# EasyEDA schematic power_driver_parallelism.json
TITLE: Sheet_1; REV: 1.0; Date: 2024-06-14; Sheet: 1/1; Drawn By: Gabriel Thien; Company: Your Company
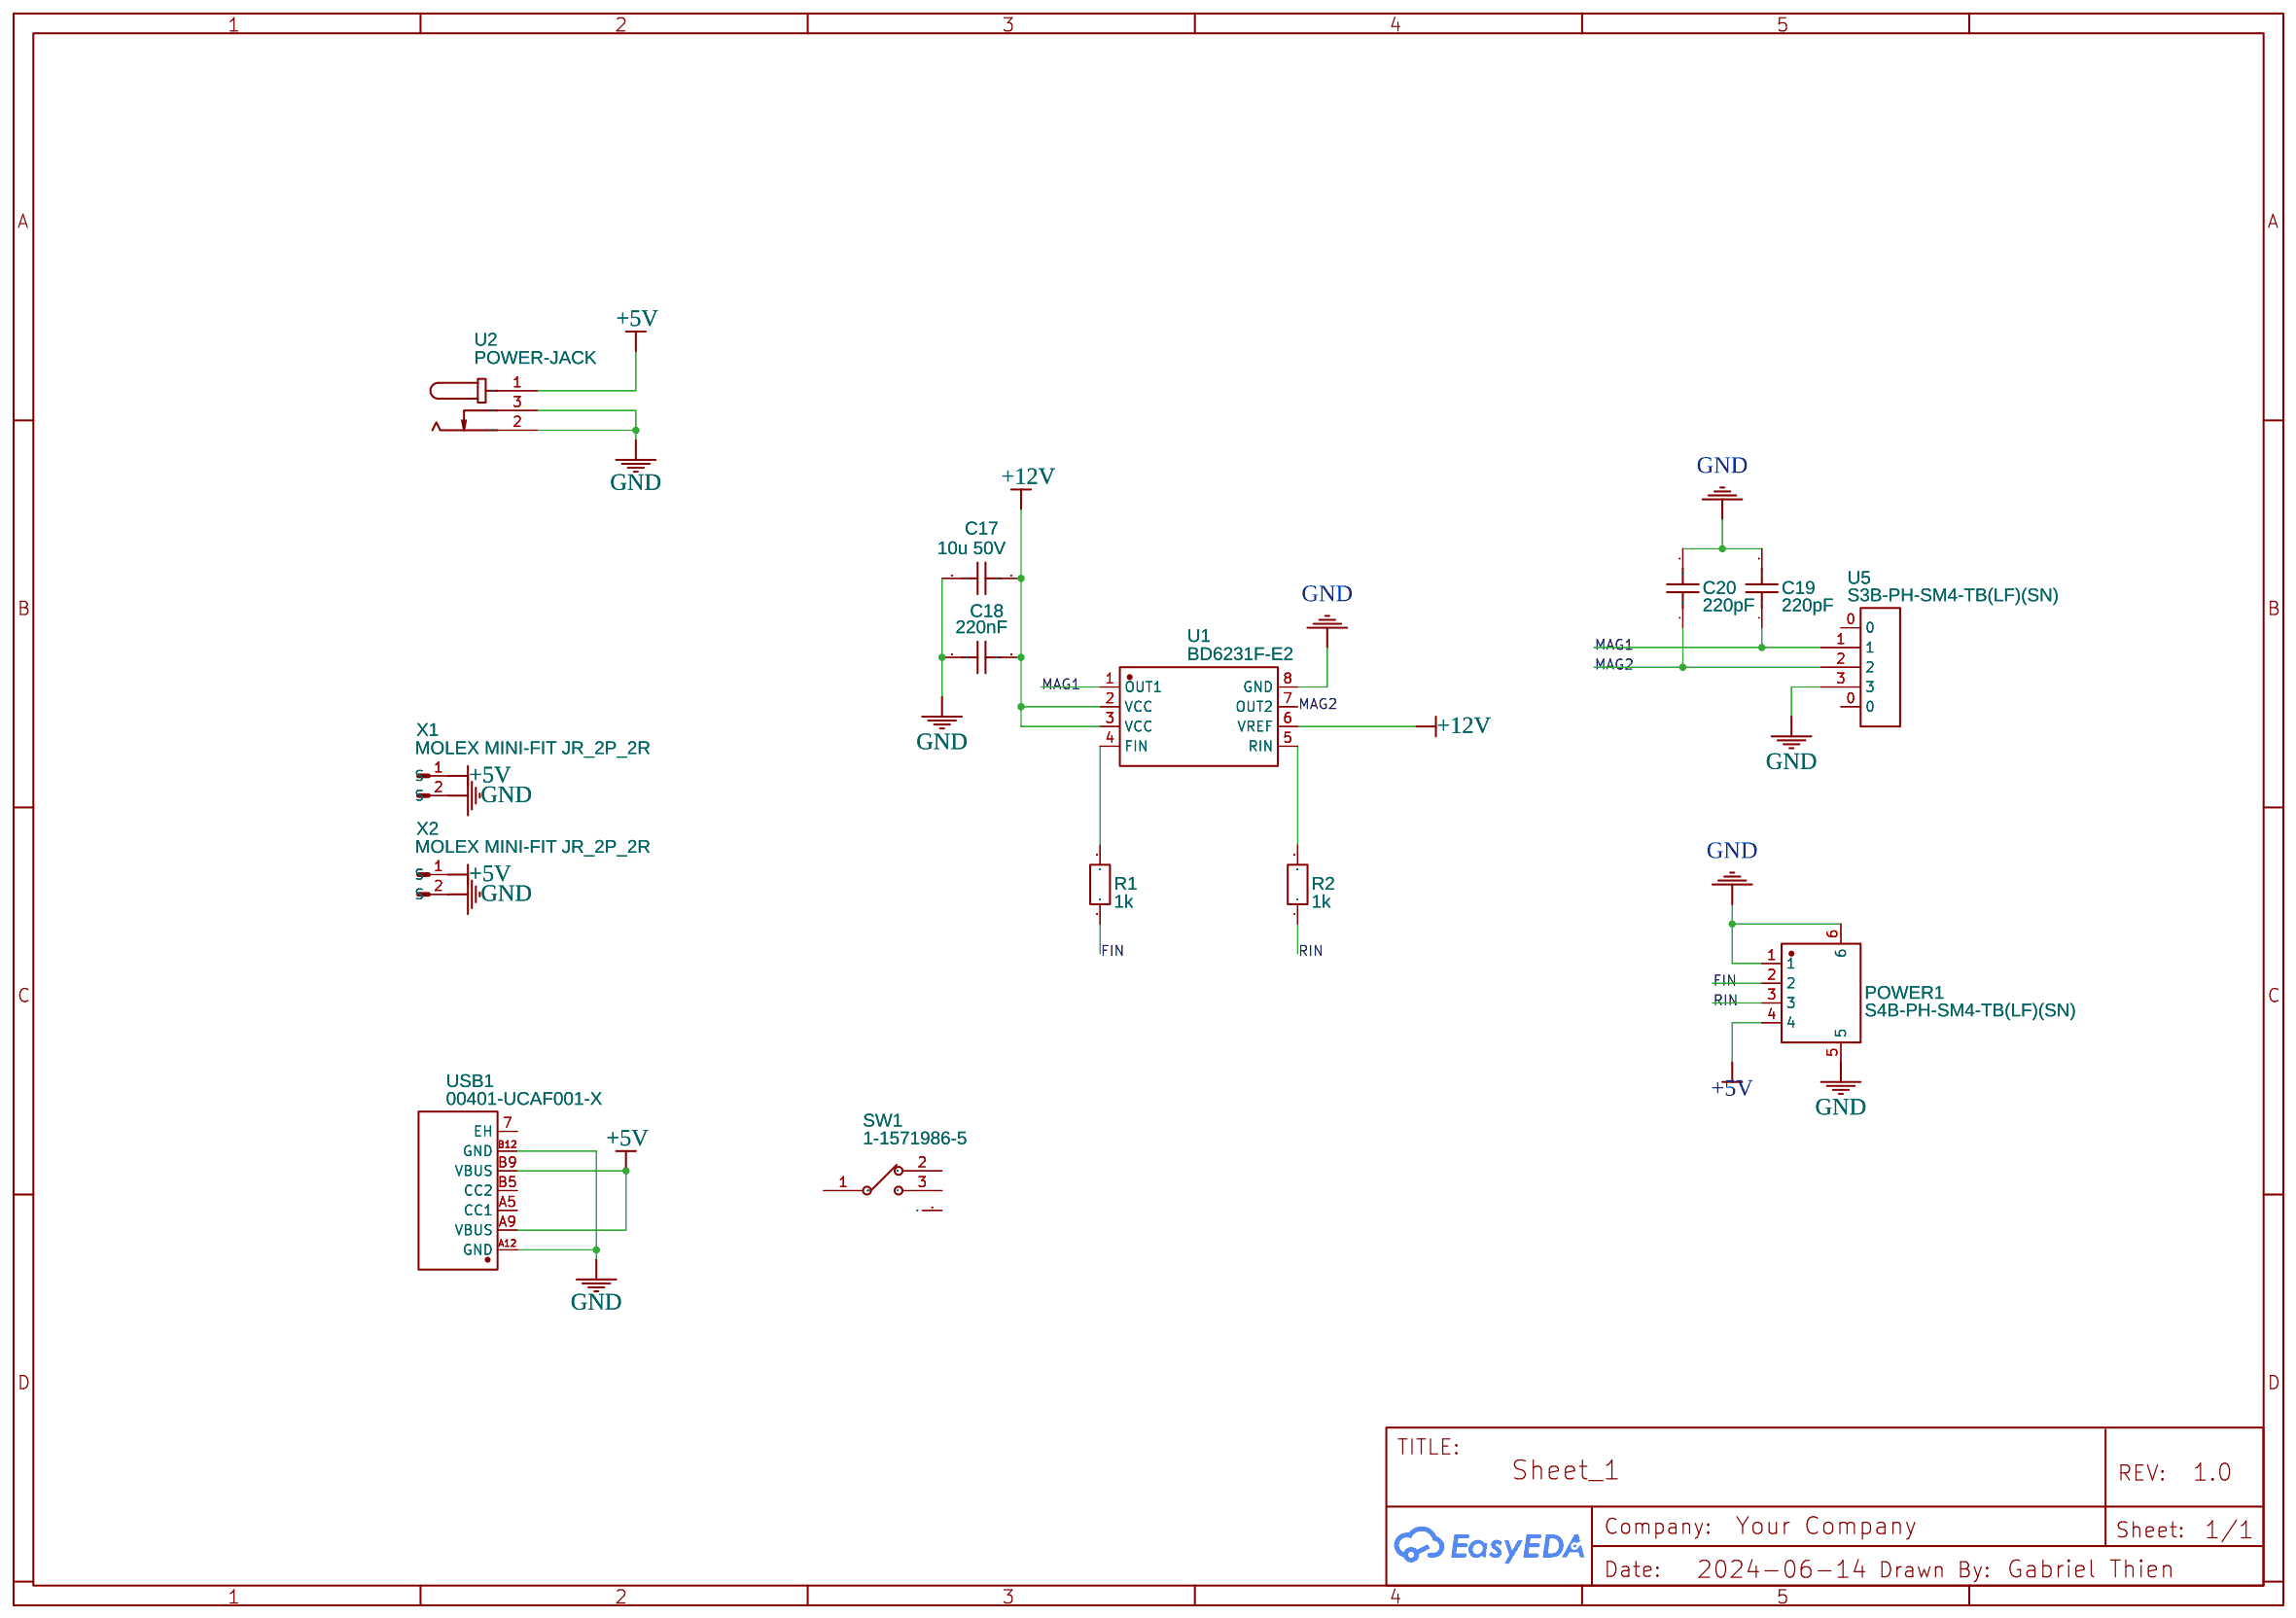
[diagram p0: schematic sheet]

## Parts
C17  10u 50V  [C0603]
C18  220nF  [C0603]
C19  220pF  [C0603]
C20  220pF  [C0603]
POWER1  S4B-PH-SM4-TB(LF)(SN)  [CONN-SMD_S4B-PH-SM4-TB-LF-SN]
R1  1k  [R0603]
R2  1k  [R0603]
SW1  1-1571986-5  [SW-TH_1-1571986-5]
U1  BD6231F-E2  [SOP-8_L5.0-W4.4-P1.27-LS6.2-BL]
U2  POWER-JACK  [DC-IN-TH_POWER-JACK]
U5  S3B-PH-SM4-TB(LF)(SN)  [CONN-SMD_S3B-PH-SM4-TB-LF-SN]
USB1  00401-UCAF001-X  [TYPE-C-SMD_TYPE-C-6P_USB4125-GF-A-0190]
X1  MOLEX MINI-FIT JR_2P_2R  [MOLEX MINI-FIT JR_2P_2R-90]
X2  MOLEX MINI-FIT JR_2P_2R  [MOLEX MINI-FIT JR_2P_2R-90]

## Library data of the parts
C17-C20 = C_0603_US: Contributor: LCEDA_Lib
POWER1 = S4B-PH-SM4-TB(LF)(SN): Contributor: LCSC; Supplier: LCSC; Supplier Part: C265102; Manufacturer: JST; JLCPCB Part Class: Extended Part
R1 R2 = R_0603_EU: Contributor: LCEDA_Lib
SW1 = 1-1571986-5: Contributor: LCSC; Supplier: LCSC; Supplier Part: C92486; Manufacturer: TE Connectivity(泰科电子); JLCPCB Part Class: Extended Part
U1 = BD6231F-E2: Contributor: LCSC; Supplier: LCSC; Supplier Part: C253180; Manufacturer: ROHM(罗姆); JLCPCB Part Class: Extended Part
U2 = POWER-JACK: Contributor: LCSC; Supplier: LCSC; Supplier Part: C9900001795; Manufacturer: 索峰; JLCPCB Part Class: Extended Part; link: https://lcsc.com/eda_search?q=C9900001795&%26type=1&ref=editor
U5 = S3B-PH-SM4-TB(LF)(SN): Contributor: LCSC; Supplier: LCSC; Supplier Part: C265101; Manufacturer: JST; JLCPCB Part Class: Extended Part
USB1 = 00401-UCAF001-X: Supplier: LCSC; Supplier Part: C3148196; Manufacturer: MINTRON(明硕); Contributor: lcsc; JLCPCB Part Class: Extended Part
X1 X2 = MOLEX MINI-FIT JR_2P_2R: Manufacturer: Molex; Manufacturer Part: 0026013114; Supplier: Mouser; Supplier Part: 538-26-01-3114; link: https://www.mouser.ch/datasheet/2/276/0026013114_PCB_HEADERS-693979.pdf

## Nets
+5V: POWER1.4 U2.1 USB1.A9(VBUS) USB1.B9(VBUS) X1.1(S) X2.1(S)
+12V: C17.2 C18.2 U1.2(VCC) U1.3(VCC) U1.6(VREF)
GND: C17.1 C18.1 C19.2 C20.2 POWER1.1 POWER1.5 POWER1.6 U1.8(GND) U2.2 U2.3 U5.3 USB1.A12(GND) USB1.B12(GND) X1.2(S) X2.2(S)
FIN: POWER1.2 R1.1
MAG1: C19.1 U1.1(OUT1) U5.1
MAG2: C20.1 U1.7(OUT2) U5.2
RIN: POWER1.3 R2.1
Net-(R1-2): R1.2 U1.4(FIN)
Net-(R2-2): R2.2 U1.5(RIN)

Not connected (* = marked no-connect by the designer): SW1 0 1(COM) 2 3; U5 0; USB1 7(EH) A5(CC1) B5(CC2)
